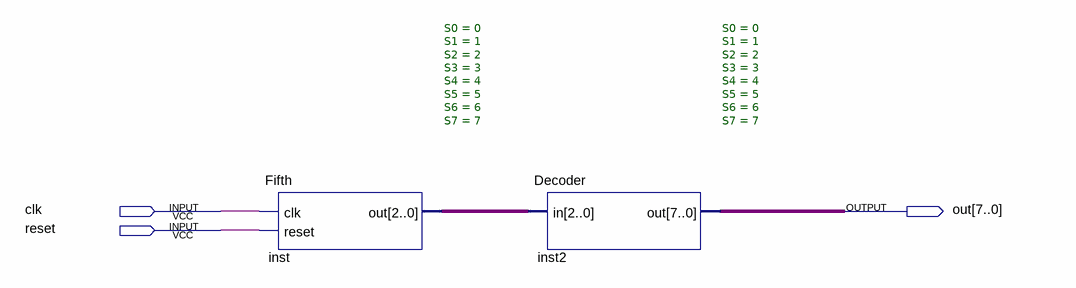
[diagram p0: schematic sheet]
// Quartus schematic FifthProject.bdf as structural Verilog: 2 symbols, 3 pins
module FifthProject (
  input  clk,
  input  reset,
  output [7:0] out
);

  wire [2:0] inst_out;

  Fifth #(.S0(0), .S1(1), .S2(2), .S3(3), .S4(4), .S5(5), .S6(6), .S7(7)) inst (
    .clk(clk), .reset(reset), .out(inst_out));
  Decoder #(.S0(0), .S1(1), .S2(2), .S3(3), .S4(4), .S5(5), .S6(6), .S7(7)) inst2 (.in(inst_out), .out(out));
endmodule
